# EAGLE design led_dip (EAGLE 6.5.0)
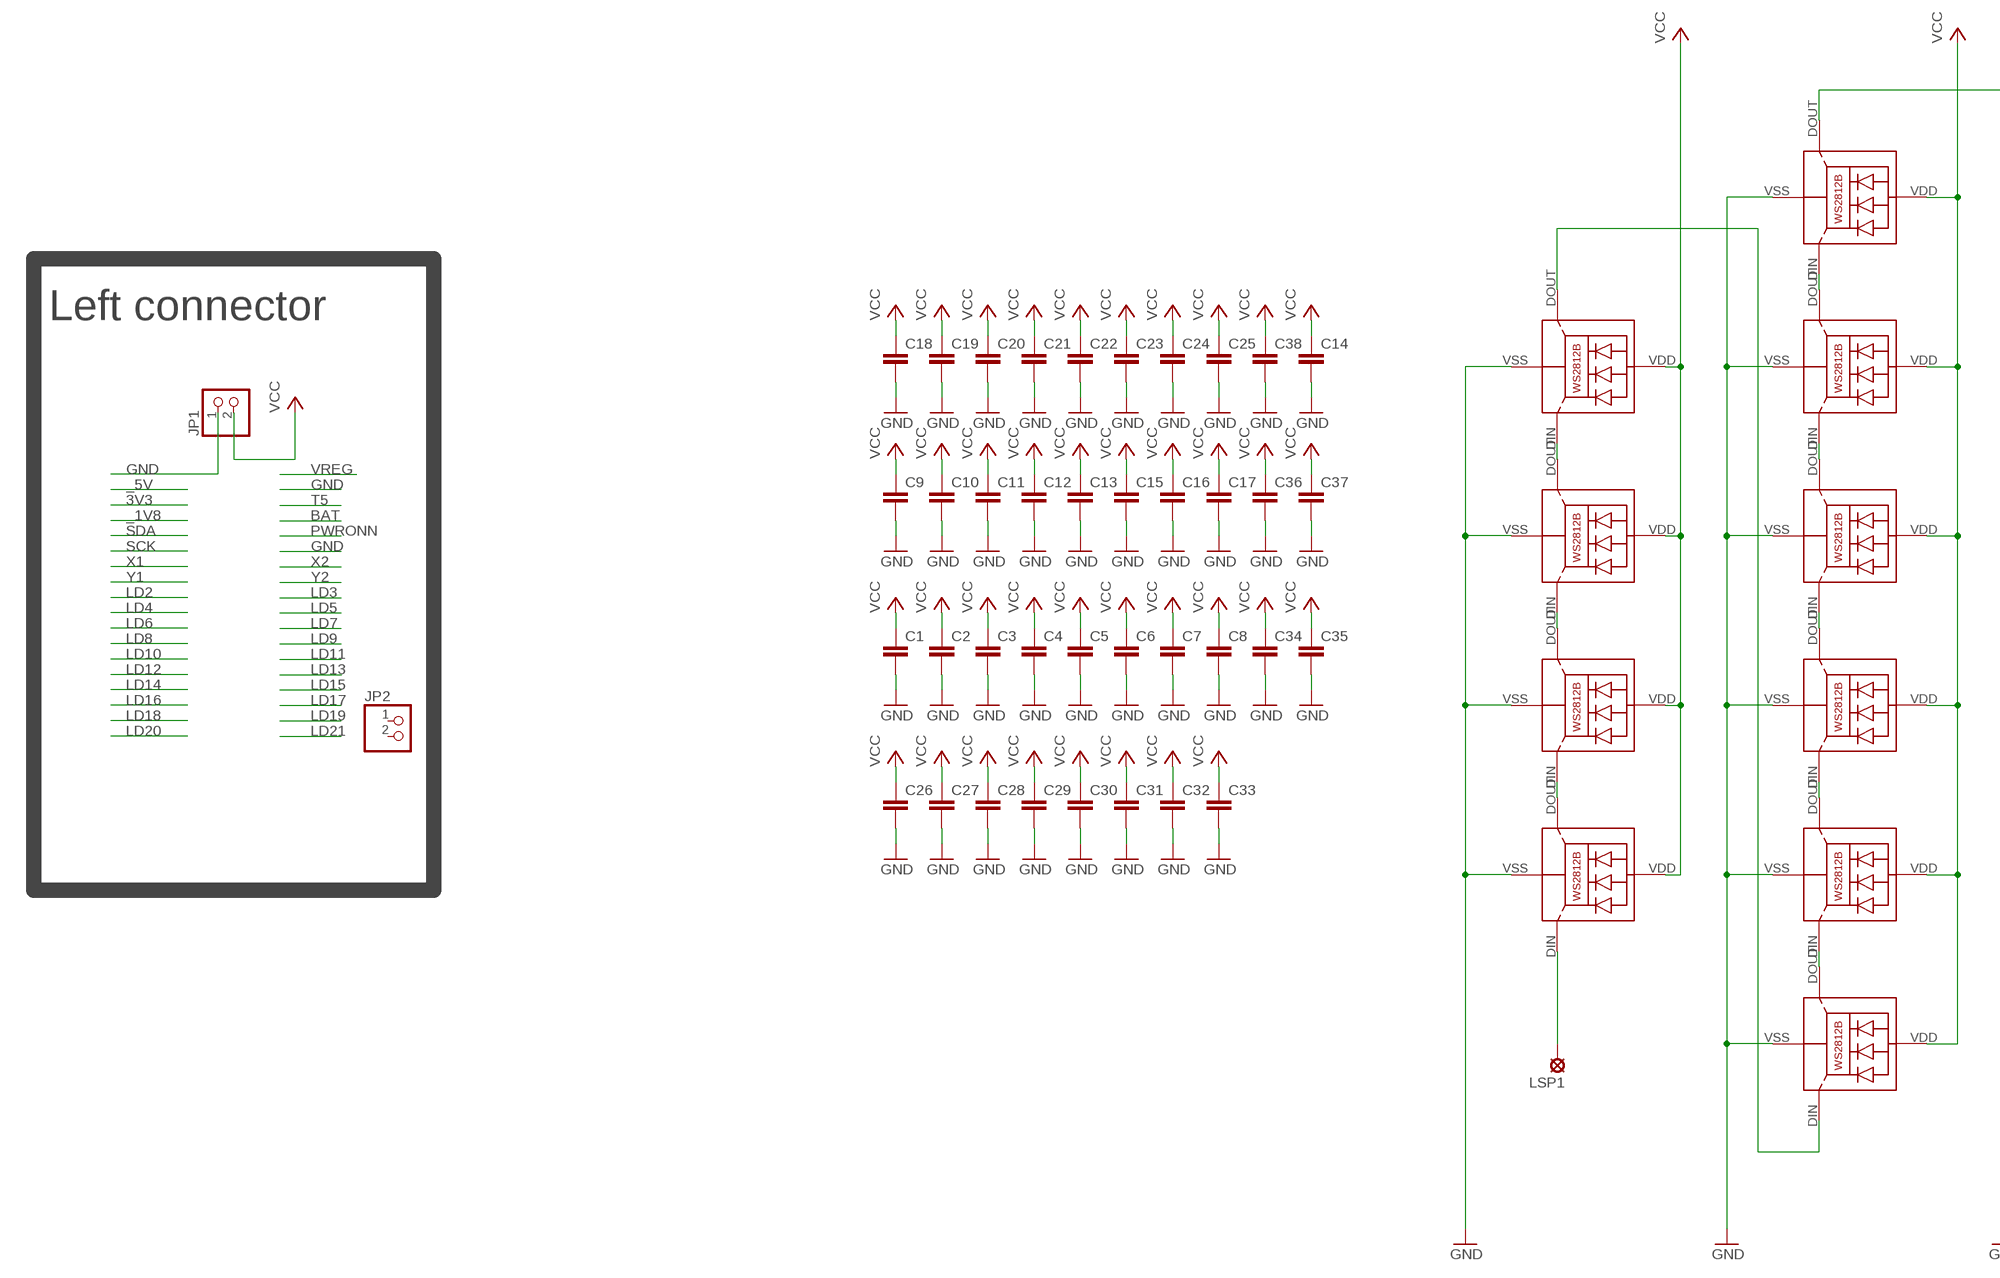
[diagram p0: schematic, sheet 1, part 1 of 2]
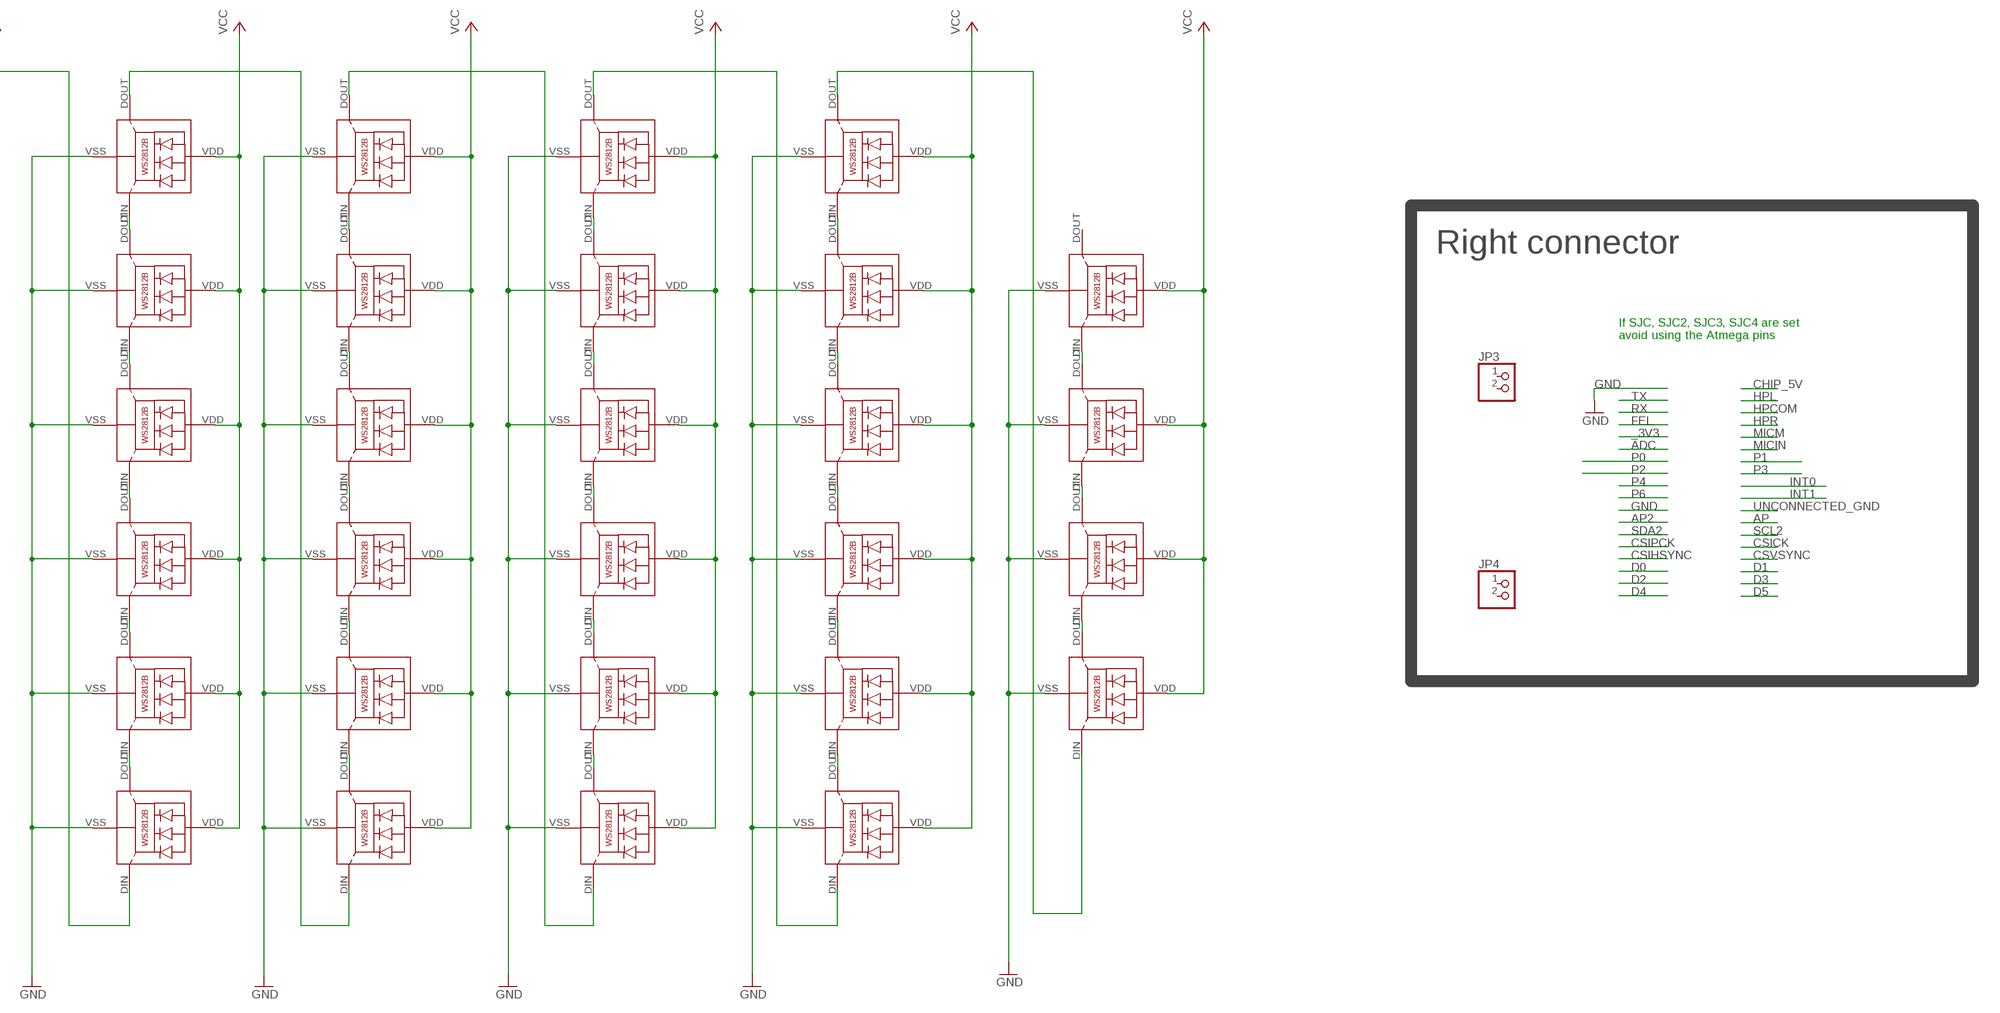
[diagram p1: schematic, sheet 1, part 2 of 2]

## Parts
C1  C-EUC0805  [C0805]
C2  C-EUC0805  [C0805]
C3  C-EUC0805  [C0805]
C4  C-EUC0805  [C0805]
C5  C-EUC0805  [C0805]
C6  C-EUC0805  [C0805]
C7  C-EUC0805  [C0805]
C8  C-EUC0805  [C0805]
C9  C-EUC0805  [C0805]
C10  C-EUC0805  [C0805]
C11  C-EUC0805  [C0805]
C12  C-EUC0805  [C0805]
C13  C-EUC0805  [C0805]
C14  C-EUC0805  [C0805]
C15  C-EUC0805  [C0805]
C16  C-EUC0805  [C0805]
C17  C-EUC0805  [C0805]
C18  C-EUC0805  [C0805]
C19  C-EUC0805  [C0805]
C20  C-EUC0805  [C0805]
C21  C-EUC0805  [C0805]
C22  C-EUC0805  [C0805]
C23  C-EUC0805  [C0805]
C24  C-EUC0805  [C0805]
C25  C-EUC0805  [C0805]
C26  C-EUC0805  [C0805]
C27  C-EUC0805  [C0805]
C28  C-EUC0805  [C0805]
C29  C-EUC0805  [C0805]
C30  C-EUC0805  [C0805]
C31  C-EUC0805  [C0805]
C32  C-EUC0805  [C0805]
C33  C-EUC0805  [C0805]
C34  C-EUC0805  [C0805]
C35  C-EUC0805  [C0805]
C36  C-EUC0805  [C0805]
C37  C-EUC0805  [C0805]
C38  C-EUC0805  [C0805]
JP1  PINHD-1X2  [1X02]
JP2  PINHD-1X2  [1X02]
JP3  PINHD-1X2  [1X02]
JP4  PINHD-1X2  [1X02]
LED1  WS2812B  [WS2812B]
LED2  WS2812B  [WS2812B]
LED3  WS2812B  [WS2812B]
LED4  WS2812B  [WS2812B]
LED5  WS2812B  [WS2812B]
LED6  WS2812B  [WS2812B]
LED7  WS2812B  [WS2812B]
LED8  WS2812B  [WS2812B]
LED9  WS2812B  [WS2812B]
LED10  WS2812B  [WS2812B]
LED11  WS2812B  [WS2812B]
LED12  WS2812B  [WS2812B]
LED13  WS2812B  [WS2812B]
LED14  WS2812B  [WS2812B]
LED15  WS2812B  [WS2812B]
LED16  WS2812B  [WS2812B]
LED17  WS2812B  [WS2812B]
LED18  WS2812B  [WS2812B]
LED19  WS2812B  [WS2812B]
LED20  WS2812B  [WS2812B]
LED21  WS2812B  [WS2812B]
LED22  WS2812B  [WS2812B]
LED23  WS2812B  [WS2812B]
LED24  WS2812B  [WS2812B]
LED25  WS2812B  [WS2812B]
LED26  WS2812B  [WS2812B]
LED27  WS2812B  [WS2812B]
LED28  WS2812B  [WS2812B]
LED30  WS2812B  [WS2812B]
LED31  WS2812B  [WS2812B]
LED32  WS2812B  [WS2812B]
LED33  WS2812B  [WS2812B]
LED34  WS2812B  [WS2812B]
LED35  WS2812B  [WS2812B]
LED36  WS2812B  [WS2812B]
LED37  WS2812B  [WS2812B]
LED38  WS2812B  [WS2812B]
LED39  WS2812B  [WS2812B]
LSP1  LSP10  [LSP10]

## Nets
GND: C1.2 C2.2 C3.2 C4.2 C5.2 C6.2 C7.2 C8.2 C9.2 C10.2 C11.2 C12.2 C13.2 C14.2 C15.2 C16.2 C17.2 C18.2 C19.2 C20.2 C21.2 C22.2 C23.2 C24.2 C25.2 C26.2 C27.2 C28.2 C29.2 C30.2 C31.2 C32.2 C33.2 C34.2 C35.2 C36.2 C37.2 C38.2 JP1.1 LED1.VSS(GND) LED2.VSS(GND) LED3.VSS(GND) LED4.VSS(GND) LED5.VSS(GND) LED6.VSS(GND) LED7.VSS(GND) LED8.VSS(GND) LED9.VSS(GND) LED10.VSS(GND) LED11.VSS(GND) LED12.VSS(GND) LED13.VSS(GND) LED14.VSS(GND) LED15.VSS(GND) LED16.VSS(GND) LED17.VSS(GND) LED18.VSS(GND) LED19.VSS(GND) LED20.VSS(GND) LED21.VSS(GND) LED22.VSS(GND) LED23.VSS(GND) LED24.VSS(GND) LED25.VSS(GND) LED26.VSS(GND) LED27.VSS(GND) LED28.VSS(GND) LED30.VSS(GND) LED31.VSS(GND) LED32.VSS(GND) LED33.VSS(GND) LED34.VSS(GND) LED35.VSS(GND) LED36.VSS(GND) LED37.VSS(GND) LED38.VSS(GND) LED39.VSS(GND)
N$1: LED14.DIN(DI) LSP1.MP
N$2: LED14.DOUT(DO) LED16.DIN(DI)
N$3: LED16.DOUT(DO) LED20.DIN(DI)
N$4: LED12.DIN(DI) LED20.DOUT(DO)
N$7: LED9.DIN(DI) LED12.DOUT(DO)
N$8: LED6.DIN(DI) LED9.DOUT(DO)
N$9: LED6.DOUT(DO) LED7.DIN(DI)
N$10: LED7.DOUT(DO) LED8.DIN(DI)
N$11: LED8.DOUT(DO) LED18.DIN(DI)
N$12: LED3.DIN(DI) LED18.DOUT(DO)
N$13: LED1.DOUT(DO) LED2.DIN(DI)
N$14: LED2.DOUT(DO) LED28.DIN(DI)
N$15: LED22.DIN(DI) LED28.DOUT(DO)
N$16: LED17.DIN(DI) LED22.DOUT(DO)
N$17: LED17.DOUT(DO) LED27.DIN(DI)
N$19: LED1.DIN(DI) LED3.DOUT(DO)
N$20: LED36.DIN(DI) LED37.DOUT(DO)
N$21: LED34.DIN(DI) LED36.DOUT(DO)
N$22: LED4.DIN(DI) LED34.DOUT(DO)
N$23: LED4.DOUT(DO) LED31.DIN(DI)
N$24: LED30.DIN(DI) LED31.DOUT(DO)
N$25: LED38.DOUT(DO) LED39.DIN(DI)
N$26: LED35.DIN(DI) LED39.DOUT(DO)
N$27: LED5.DIN(DI) LED35.DOUT(DO)
N$28: LED5.DOUT(DO) LED32.DIN(DI)
N$29: LED32.DOUT(DO) LED33.DIN(DI)
N$30: LED13.DIN(DI) LED15.DOUT(DO)
N$31: LED11.DIN(DI) LED13.DOUT(DO)
N$32: LED11.DOUT(DO) LED25.DIN(DI)
N$33: LED10.DIN(DI) LED25.DOUT(DO)
N$34: LED10.DOUT(DO) LED19.DIN(DI)
N$35: LED21.DIN(DI) LED26.DOUT(DO)
N$36: LED21.DOUT(DO) LED23.DIN(DI)
N$37: LED23.DOUT(DO) LED24.DIN(DI)
N$42: LED27.DOUT(DO) LED37.DIN(DI)
N$43: LED30.DOUT(DO) LED38.DIN(DI)
N$44: LED15.DIN(DI) LED33.DOUT(DO)
N$45: LED19.DOUT(DO) LED26.DIN(DI)
VCC: C1.1 C2.1 C3.1 C4.1 C5.1 C6.1 C7.1 C8.1 C9.1 C10.1 C11.1 C12.1 C13.1 C14.1 C15.1 C16.1 C17.1 C18.1 C19.1 C20.1 C21.1 C22.1 C23.1 C24.1 C25.1 C26.1 C27.1 C28.1 C29.1 C30.1 C31.1 C32.1 C33.1 C34.1 C35.1 C36.1 C37.1 C38.1 JP1.2 LED1.VDD LED2.VDD LED3.VDD LED4.VDD LED5.VDD LED6.VDD LED7.VDD LED8.VDD LED9.VDD LED10.VDD LED11.VDD LED12.VDD LED13.VDD LED14.VDD LED15.VDD LED16.VDD LED17.VDD LED18.VDD LED19.VDD LED20.VDD LED21.VDD LED22.VDD LED23.VDD LED24.VDD LED25.VDD LED26.VDD LED27.VDD LED28.VDD LED30.VDD LED31.VDD LED32.VDD LED33.VDD LED34.VDD LED35.VDD LED36.VDD LED37.VDD LED38.VDD LED39.VDD
Unconnected: JP2.1 JP2.2 JP3.1 JP3.2 JP4.1 JP4.2 LED24.DOUT(DO)

## Notes on the sheet
- Left connector | Right connector
- If SJC, SJC2, SJC3, SJC4 are set 
  avoid using the Atmega pins

## Library data of the parts
C1-C38 = rcl:C-EU: CAPACITOR, European symbol
JP1-JP4 = pinhead:PINHD-1X2: PIN HEADER
LED1-LED28 LED30-LED39 = WS2812B:WS2812B: Features and Benefits  * Intelligent reverse connect protection, the power supply reverse connection does not damage the IC. * The control circuit and the LED share the only power source. Control circuit and RGB chip are integrated in a package of 5050 components, form a complete control of pixel point.  * Built-in signal reshaping circuit, after wave reshaping to the next driver, ensure wave-form distortion not accumulate.  * Built-in electric reset circuit and power lost reset circuit.  * Each pixel of the three primary color can achieve 256 brightness display, completed 16777216 color full color display, and scan frequency not less than 400Hz/s.  * Cascading port transmission signal by single line.  * Any two point the distance more than 5m transmission signal without any increase circuit.  * When the refresh rate is 30fps, cascade number are not less than1024 points.  * Send data at speeds of 800Kbps.  *The color of the light were highly consistent, cost-effective. Applications  Full-color module, Full color soft lights a lamp strip. LED decorative lighting, Indoor/outdoor LED video irregular screen. General description WS2812B is a intelligent control LED light source that the control circuit and RGB chip are integrated in a package of 5050 components. It internal include intelligent digital port data latch and signal reshaping amplification drive circuit. Also include a precision internal oscillator and a 12V voltage programmable constant curre-nt control part, effectively ensuring the pixel point light color height consistent. The data transfer protocol use single NZR communication mode. After the pixel power-on reset, the DIN port receive data from controller, the first pixel collect initial 24bit data then sent to the internal data latch, the other data which reshaping by the internal signal reshaping amplification circuit sent to the next cascade pixel through the DO port. After transmission for each pixel,the signal to reduce 24bit. pixel adopt auto reshaping transmit technology, making the pixel cascade number is not limited the signal transmission, only depend on the speed of signal transmission. LED with low driving voltage, environmental protection and energy saving, high brightness, scattering angle is large, good consistency, low power, long life and other advantages. The control chip integrated in LED above becoming more simple circuit, small volume, convenient installation. Absolute Maximum Ratings Power supply voltage: VDD +3.5V..+5.3V Input voltage: VI -0.5V..VDD+0.5V based on WS2812 from https://github.com/adafruit/Adafruit-Eagle-Library
LSP1 = solpad:LSP10: SOLDER PAD drill 1.0 mm, distributor Buerklin, 12H555

## Board
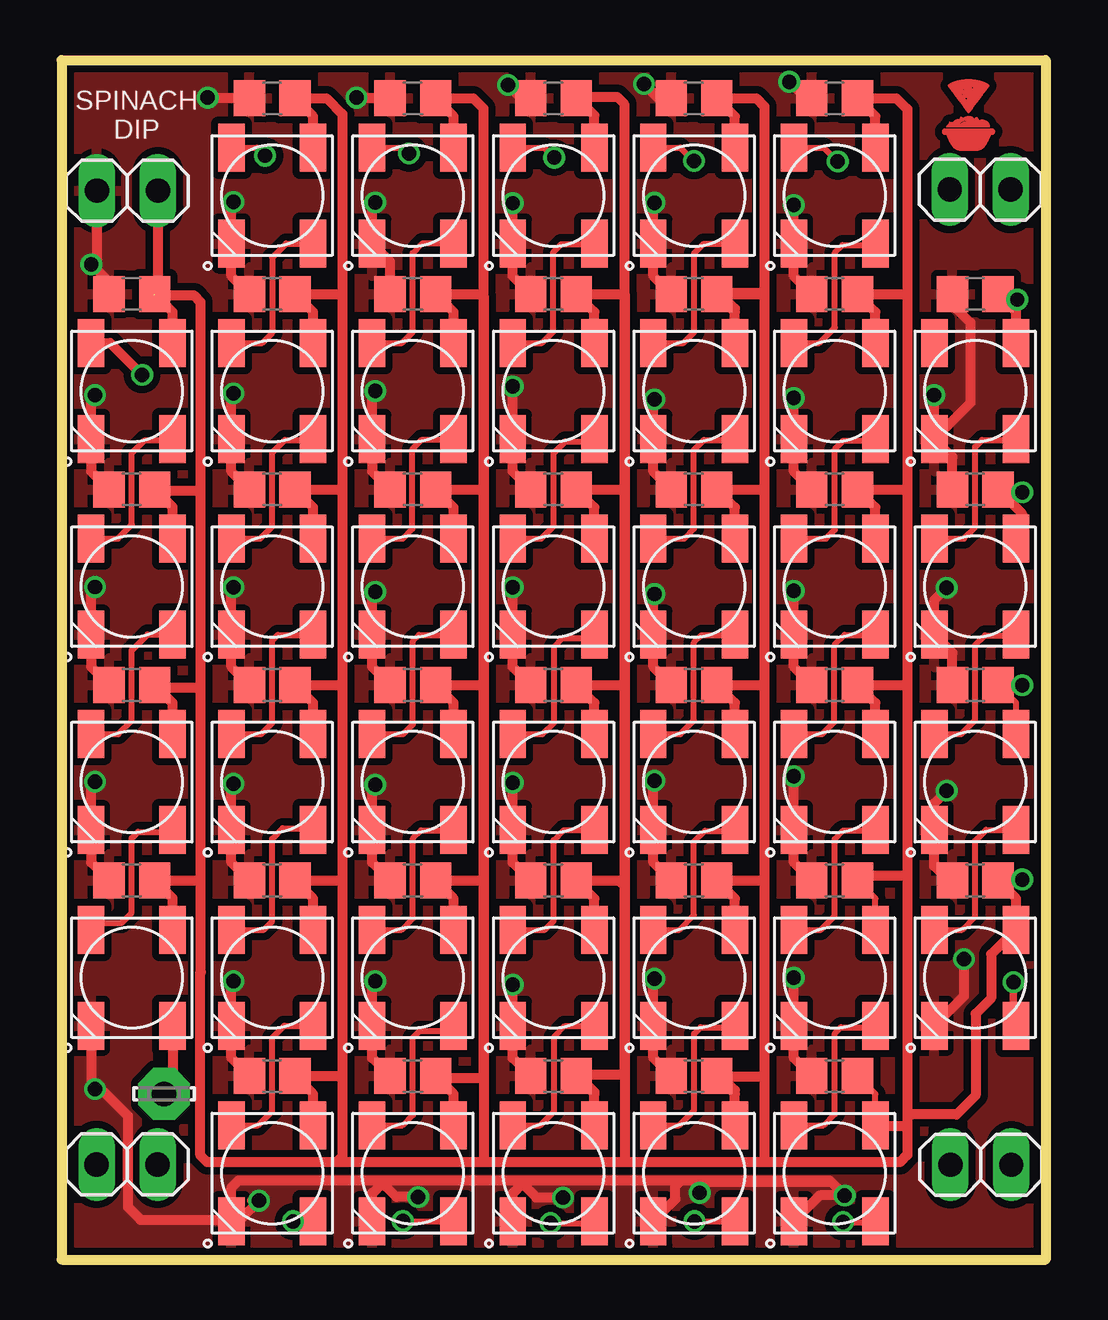
[diagram p2: board, top side]
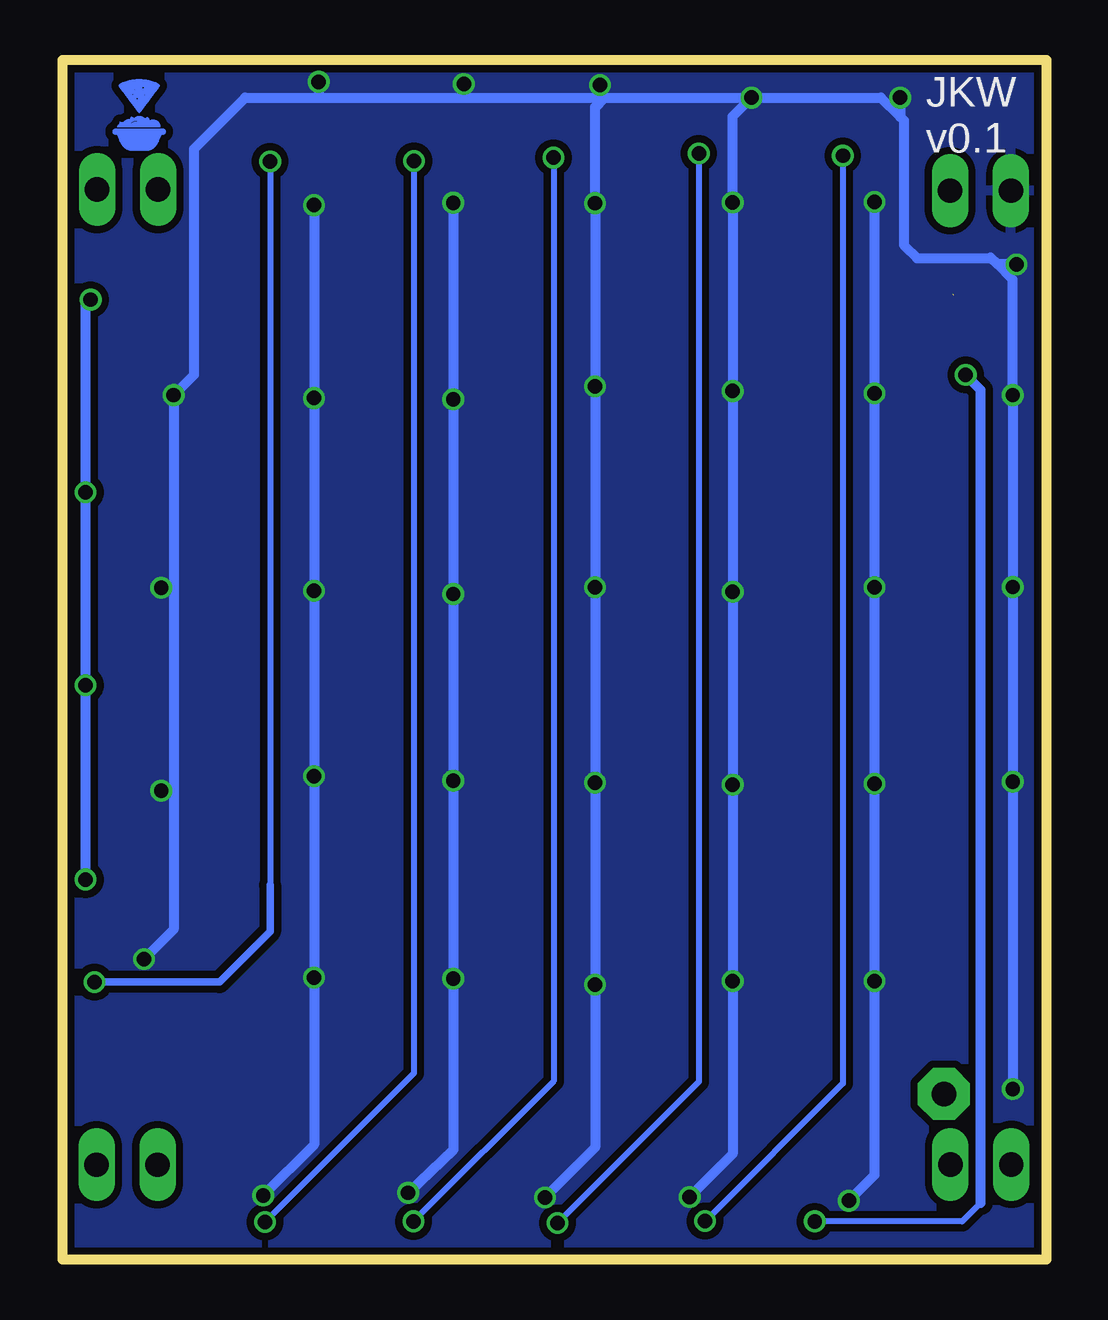
[diagram p3: board, bottom side, seen from below]

Size 41 x 50 mm. Coordinates in mm from the lower left corner, seen from the top.
Outline: 0,50 41,50 41,0 0,0 0,50
Copper layers (1*16): Top 0.035mm / dielectric 1.5mm / Bottom 0.035mm
Design rules "SeeedStudio_2layer_DRU_no_angle_20140221": minimum track width 6mil, minimum drill 12mil, track to track 6mil, track to pad 6mil, pad to pad 6mil, via to via 6mil, smd to smd 0mil, copper to edge 10mil, drill to drill 10mil, minimum pad ring 10mil, minimum via ring 6mil, stop-mask expansion 2mil, vias tented up to drill 100mil, thermal gap 10mil

### Footprints (pad centres in the part's own frame; a part is rotated, then mirrored left to right if it is on the bottom)
C0805 = smd 1.3 x 1.5: 1 -0.95,0; 2 0.95,0
1X02 = drill 1.016 long: 1 -1.27,0; 2 1.27,0
WS2812B = smd 2 x 1.1: DIN 2,1.7; DOUT -2,-1.7; VDD -2,1.7; VSS 2,-1.7
LSP10 = drill 1.016 pad 2.159 octagon: MP 0,0

### Placement (x,y rotation side)
C1  8.78,7.65 180 top
C2  8.78,15.8 180 top
C3  20.5,7.65 180 top
C4  26.36,7.65 180 top
C5  32.21,7.65 180 top
C6  14.64,48.4 180 top
C7  20.5,48.4 180 top
C8  26.36,48.4 180 top
C9  38.07,40.25 180 top
C10  32.21,48.4 180 top
C11  2.93,40.25 180 top
C12  8.78,40.25 180 top
C13  14.64,40.25 180 top
C14  8.78,48.4 180 top
C15  20.5,40.25 180 top
C16  26.36,40.25 180 top
C17  32.21,40.25 180 top
C18  2.93,32.1 180 top
C19  8.78,32.1 180 top
C20  14.64,32.1 180 top
C21  20.5,32.1 180 top
C22  26.36,32.1 180 top
C23  32.21,32.1 180 top
C24  38.07,32.1 180 top
C25  2.93,23.95 180 top
C26  8.78,23.95 180 top
C27  14.64,23.95 180 top
C28  20.5,23.95 180 top
C29  26.36,23.95 180 top
C30  32.21,23.95 180 top
C31  38.07,23.95 180 top
C32  2.93,15.8 180 top
C33  14.64,15.8 180 top
C34  20.5,15.8 180 top
C35  26.36,15.8 180 top
C36  32.21,15.8 180 top
C37  38.07,15.8 180 top
C38  14.64,7.65 180 top
JP1  2.74,44.55 0 top
JP2  2.73,3.96 180 top
JP3  38.28,44.6 0 top
JP4  38.3,3.95 0 top
LED1  14.64,3.6 270 top
LED2  14.64,11.75 270 top
LED3  8.78,44.35 270 top
LED4  20.5,28.05 270 top
LED5  26.36,28.05 270 top
LED6  8.78,11.75 270 top
LED7  8.78,19.9 270 top
LED8  8.78,28.05 270 top
LED9  8.78,3.6 270 top
LED10  32.21,36.2 270 top
LED11  32.21,19.9 270 top
LED12  2.93,36.2 270 top
LED13  32.21,11.75 270 top
LED14  2.93,11.75 270 top
LED15  32.21,3.6 270 top
LED16  2.93,19.9 270 top
LED17  14.64,36.2 270 top
LED18  8.78,36.2 270 top
LED19  32.21,44.35 270 top
LED20  2.93,28.05 270 top
LED21  38.07,19.9 270 top
LED22  14.64,28.05 270 top
LED23  38.07,28.05 270 top
LED24  38.07,36.2 270 top
LED25  32.21,28.05 270 top
LED26  38.07,11.75 270 top
LED27  14.64,44.35 270 top
LED28  14.64,19.9 270 top
LED30  20.5,44.35 270 top
LED31  20.5,36.2 270 top
LED32  26.36,36.2 270 top
LED33  26.36,44.35 270 top
LED34  20.5,19.9 270 top
LED35  26.36,19.9 270 top
LED36  20.5,11.75 270 top
LED37  20.5,3.6 270 top
LED38  26.36,3.6 270 top
LED39  26.36,11.75 270 top
LSP1  4.27,6.9 0 top
U$2  LOGO  [LOGO]  36.5,46.1 0 top
U$5  LOGO  [LOGO]  39.09,46.1 0 bottom

### Tracks (layer width: path | path; a pad name or v marks a point on that pad's centre or on a via)
GND  (via drill 0.6)
  Top 0.254: 26.94,3.23 26.94,3.13 v26.59,2.78
  Top 0.406: C13.2 13.69,41.6 LED27.VSS 12.94,43.93 v13.07,44.06 | v14.86,2.61 13.95,2.61 13.95,2.62 13.37,3.2 | v1.4,36.03 1.23,35.86 LED12.VSS 1.23,32.85 C18.2 | v7.16,44.08 7.08,44 LED3.VSS 7.08,41 C12.2 | 7.93,2.45 v8.23,2.45 7.51,1.73 7.2,1.73 7.12,1.65 3.3,1.65 2.76,2.19 2.76,6 1.66,7.1 v1.4,7.1 1.23,7.27 LED14.VSS | v18.8,44.03 LED30.VSS 18.8,41 C15.2 | v20.89,2.58 19.78,2.58 19.78,2.59 19.2,3.17 18.8,2.77 LED37.VSS | v24.71,44.05 24.66,44 LED33.VSS 24.66,41 C16.2 | LED38.VSS 25.58,2.52 25.58,3.06 25.82,3.3 | v30.51,43.95 LED19.VSS 30.51,41 C17.2 | v32.63,2.67 31.58,2.67 LED15.VSS | LED24.VSS 36.37,36.02 v36.36,36.03 | v37.6,12.52 37.6,10.98 LED26.VSS | C37.2 36.96,15.8 36.36,16.4 36.36,17.89 | 36.36,17.89 LED21.VSS | C31.2 37.12,25.3 LED23.VSS 36.37,27.49 v36.88,28 | C24.2 37.12,33.45 LED24.VSS | 36.36,17.89 36.36,19.02 v36.88,19.54 | v7.16,36.1 7.08,36.02 LED18.VSS 7.08,32.85 C19.2 | v7.16,28.02 7.08,27.94 LED8.VSS 7.08,24.7 C26.2 | v7.16,19.83 7.08,19.75 LED7.VSS 7.08,16.55 C2.2 | v7.16,11.6 7.08,11.52 LED6.VSS 7.08,8.4 C1.2 | v13.07,11.6 12.94,11.47 LED2.VSS 12.94,8.4 C38.2 | v18.8,11.46 LED36.VSS 18.8,8.4 C3.2 | v24.71,11.71 24.66,11.66 LED39.VSS 24.66,8.4 C4.2 | v24.71,19.96 24.66,19.91 LED35.VSS 24.66,16.55 C35.2 | v18.8,19.88 LED34.VSS 18.8,16.55 C34.2 | v13.07,19.79 12.94,19.66 LED28.VSS 12.94,16.55 C33.2 | v1.4,19.92 1.23,19.75 LED16.VSS 1.23,16.55 C32.2 | v1.4,28.03 1.23,27.86 LED20.VSS 1.23,24.7 C25.2 | v13.07,27.83 12.94,27.7 LED22.VSS 12.94,24.7 C27.2 | v13.07,36.2 12.94,36.07 LED17.VSS 12.94,32.85 C20.2 | v18.8,36.4 LED31.VSS 18.8,32.85 C21.2 | v18.8,28.02 LED4.VSS 18.8,24.7 C28.2
  Top 0.406: v30.51,11.75 LED13.VSS 30.51,8.4 C5.2 | v30.51,20.15 LED11.VSS 30.51,16.55 C36.2 | v24.71,27.74 24.66,27.69 LED5.VSS 24.66,24.7 C29.2 | v30.51,27.88 LED25.VSS 30.51,24.7 C30.2 | v24.71,35.85 24.66,35.8 LED32.VSS 24.66,32.85 C22.2 | v30.51,35.91 LED10.VSS 30.51,32.85 C23.2 | C11.2 1.98,40.74 v1.24,41.48 1.47,41.71 JP1.1 | C6.2 12.32,48.4 v12.29,48.43 | C10.2 31.01,48.4 v30.32,49.09 | C8.2 24.87,48.4 v24.27,49 | C7.2 19.16,48.4 v18.6,48.96 | 26.94,3.23 32.07,3.23 v32.63,2.67 | LED9.VSS 7.08,3 7.38,3.3 13.27,3.3 | 13.27,3.3 25.82,3.3 | 25.82,3.3 32,3.3 v32.63,2.67 | 13.37,3.2 13.27,3.3 | LED1.VSS 12.94,2.77 13.37,3.2 | C9.2 37.12,39.81 37.87,39.06 37.87,35.7 LED24.VSS | C14.2 6.12,48.4 v6.09,48.43
  Bottom 0.406: v14.86,2.61 13.07,4.4 v13.07,11.6 v13.07,19.79 v13.07,27.83 v13.07,36.2 v13.07,44.06 13.07,47.65 v12.29,48.43 | 1.33,7.03 v1.4,7.1 v1.4,19.92 v1.4,28.03 v1.4,36.03 1.4,40.85 2.03,41.48 | v7.16,44.08 v7.16,36.1 v7.16,28.02 v7.16,19.83 v7.16,11.6 7.16,3.52 v8.23,2.45 | v20.89,2.58 18.8,4.67 v18.8,11.46 v18.8,19.88 v18.8,28.02 v18.8,36.4 v18.8,44.03 18.8,48.04 18.41,48.43 | v24.71,44.05 v24.71,35.85 v24.71,27.74 v24.71,19.96 v24.71,11.71 24.71,4.58 v26.59,2.78 | v30.51,43.95 v30.51,35.91 v30.51,27.88 v30.51,20.15 v30.51,11.75 30.51,4.79 v32.63,2.67 | v36.36,36.03 36.36,28 | 36.36,28 36.36,19.54 | 36.36,19.54 36.36,13.76 v37.6,12.52 | v36.88,28 36.36,28 | v36.88,19.54 36.36,19.54 | 36.37,36.02 35.51,36.88 35.51,46.3 33.38,48.43 30.32,48.43 | 30.32,48.43 24.27,48.43 | 24.27,48.43 18.6,48.43 | 18.6,48.43 18.41,48.43 | 18.41,48.43 v12.29,48.43 | v12.29,48.43 6.89,48.43 6.09,47.63 | 2.03,41.48 2.32,41.77 2.36,41.73 5.38,41.73 5.94,42.29 5.94,47.48 6.09,47.63 | v1.24,41.48 2.03,41.48 | v30.32,49.09 30.32,48.43 | v24.27,49 24.27,48.43 | v18.6,48.96 18.6,48.43 | v6.09,48.43 6.09,47.63
  pour Top (isolate 0.305, rank 2): -0.07,0.25 40.88,0.25 41.01,10.57 41.01,50.01 0,50.01 0,10.47
  pour Bottom (isolate 0.305): 0,50 41.05,50 41.05,0.25 0.02,0.25 0.02,49.92
N$1
  Top 0.406: LED14.DIN 4.63,7.26 LSP1.MP
N$2
  Top 0.254: 1.12,14.04 2.51,14.04 2.92,14.45 2.92,17.56 3.19,17.83 4.56,17.83 LED16.DIN
  Top 0.305: LED14.DOUT 1.12,13.75 1.12,14.04
N$3
  Top 0.254: LED16.DOUT 2.37,21.9 2.92,22.45 2.92,25.39 3.59,26.06 4.62,26.06 LED20.DIN
N$4
  Top 0.254: LED20.DOUT 2.35,30.05 2.93,30.63 2.93,33.61 3.47,34.15 4.58,34.15 LED12.DIN
N$7  (via drill 0.6)
  Top 0.254: v9.65,1.59 LED9.DIN
  Top 0.406: LED12.DOUT 2.03,38.2 v3.36,36.87
  Bottom 0.254: 2.74,2.36 3.51,1.59 v9.65,1.59
  Bottom 0.406: 2.74,2.36 2.74,36.25 v3.36,36.87
N$8
  Top 0.254: LED9.DOUT 8.2,5.6 8.78,6.18 8.78,9.23 9.29,9.74 LED6.DIN
N$9
  Top 0.254: LED6.DOUT 8.43,13.75 8.77,14.09 8.77,17.54 9.2,17.97 10.41,17.97 LED7.DIN
N$10
  Top 0.254: LED7.DOUT 8.32,21.9 8.78,22.36 8.78,25.81 9.01,26.04 LED8.DIN
N$11
  Top 0.254: LED8.DOUT 8.28,30.05 8.78,30.55 8.78,33.63 9.31,34.16 10.44,34.16 LED18.DIN
N$12
  Top 0.254: LED18.DOUT 8.36,38.2 8.78,38.62 8.78,41.77 9.36,42.35 LED3.DIN
N$13
  Top 0.254: LED1.DOUT 14.21,5.6 14.64,6.03 14.64,9.25 14.93,9.54 16.13,9.54 LED2.DIN
N$14
  Top 0.254: LED2.DOUT 14.17,13.75 14.64,14.22 14.64,17.55 14.98,17.89 LED28.DIN
N$15
  Top 0.254: LED28.DOUT 14.23,21.9 14.64,22.31 14.64,25.78 14.9,26.04 LED22.DIN
N$16
  Top 0.254: LED22.DOUT 14.21,30.05 14.62,30.46 14.62,33.78 15.01,34.17 16.31,34.17 LED17.DIN
N$17
  Top 0.254: LED17.DOUT 14.18,38.2 14.63,38.65 14.63,41.95 15.04,42.36 LED27.DIN
N$19  (via drill 0.6)
  Top 0.254: LED3.DOUT 8.14,46.35 v8.48,46.01 | v14.22,1.6 LED1.DIN
  Bottom 0.254: v8.48,46.01 8.48,7.34 v14.22,1.6
N$20
  Top 0.254: LED37.DOUT 19.95,5.6 20.51,6.16 20.51,9.27 20.97,9.73 22.18,9.73 LED36.DIN
N$21
  Top 0.254: LED36.DOUT 20.14,13.75 20.5,14.11 20.5,17.47 20.93,17.9 LED34.DIN
N$22
  Top 0.254: LED34.DOUT 20.05,21.9 20.52,22.37 20.52,25.55 20.87,25.9 22.05,25.9 LED4.DIN
N$23
  Top 0.254: LED4.DOUT 19.98,30.05 20.5,30.57 20.5,33.62 20.98,34.1 22.1,34.1 LED31.DIN
N$24
  Top 0.254: LED31.DOUT 20.01,38.2 20.49,38.68 20.49,41.99 20.82,42.32 22.17,42.32 LED30.DIN
N$25
  Top 0.254: LED38.DOUT 25.74,5.6 26.36,6.22 26.36,9.41 26.63,9.68 27.99,9.68 LED39.DIN
N$26
  Top 0.254: LED39.DOUT 25.74,13.75 26.35,14.36 26.35,17.4 26.82,17.87 28.03,17.87 LED35.DIN 28.08,17.88
N$27
  Top 0.254: LED35.DOUT 25.79,21.9 26.35,22.46 26.35,25.71 26.67,26.03 28.04,26.03 LED5.DIN
N$28
  Top 0.254: LED5.DOUT 25.94,30.05 26.35,30.46 26.35,33.75 26.76,34.16 28.02,34.16 LED32.DIN
N$29
  Top 0.254: LED32.DOUT 25.91,38.2 26.36,38.65 26.36,41.94 26.76,42.34 28.05,42.34 LED33.DIN
N$30
  Top 0.254: LED15.DOUT 31.75,5.6 32.22,6.07 32.22,9.43 32.47,9.68 33.84,9.68 LED13.DIN 33.86,9.7
N$31
  Top 0.254: LED13.DOUT 31.64,13.75 32.21,14.32 32.21,17.53 32.56,17.88 33.89,17.88 LED11.DIN
N$32
  Top 0.254: LED11.DOUT 31.69,21.9 32.2,22.41 32.2,25.61 32.63,26.04 LED25.DIN
N$33
  Top 0.254: LED25.DOUT 31.85,30.05 32.22,30.42 32.22,33.78 32.57,34.13 33.84,34.13 LED10.DIN
N$34
  Top 0.254: LED10.DOUT 31.57,38.2 32.22,38.85 32.22,41.96 32.55,42.29 33.85,42.29 LED19.DIN
N$35
  Top 0.254: LED26.DOUT 37.52,13.75 38.07,14.3 38.07,17.45 38.53,17.91 LED21.DIN
N$36
  Top 0.254: LED21.DOUT 37.48,21.9 38.07,22.49 38.07,25.61 38.48,26.02 39.74,26.02 LED23.DIN
N$37
  Top 0.254: LED23.DOUT 37.6,30.05 38.07,30.52 38.07,33.87 38.36,34.16 39.73,34.16 LED24.DIN
N$42  (via drill 0.6)
  Top 0.254: LED27.DOUT 14.24,46.35 v14.48,46.11 | v20.37,1.52 22.12,1.52 LED37.DIN
  Bottom 0.254: v14.48,46.11 14.48,7.41 v20.37,1.52
N$43  (via drill 0.6)
  Top 0.254: LED30.DOUT 20.11,46.35 v20.53,45.93 | v26.37,1.59 28.05,1.59 LED38.DIN
  Bottom 0.254: v20.53,45.93 20.53,7.43 v26.37,1.59
N$44  (via drill 0.6)
  Top 0.254: LED33.DOUT 25.79,46.35 v26.35,45.79 | v32.56,1.56 33.87,1.56 LED15.DIN
  Bottom 0.254: v26.35,45.79 26.35,7.77 v32.56,1.56
N$45  (via drill 0.6)
  Top 0.254: LED19.DOUT 31.76,46.35 v32.34,45.77
  Top 0.305: v39.66,11.56 39.66,9.86 LED26.DIN
  Bottom 0.254: v32.34,45.77 32.34,15.61
  Bottom 0.305: 32.34,15.61 32.34,13.68 34.45,11.57 v39.65,11.57 v39.66,11.56
VCC  (via drill 0.6)  (1 unrouted)
  Top 0.254: LED15.VDD 33.91,6.9 C5.1 | LED13.VDD 33.91,15.05 C36.1 | LED21.VDD 39.77,23.2 C31.1 | LED30.VDD 22.2,47.65 C7.1
  Top 0.305: 35.43,6.04 35.24,5.85
  Top 0.406: LED30.VDD 22.2,47.69 21.43,48.46 23.15,48.46 23.44,48.17 23.44,40.27 | 23.44,40.27 23.44,32.02 | 23.44,32.02 23.44,24.07 | 23.44,24.07 23.44,15.57 | 23.44,15.57 23.44,7.71 21.47,7.71 22.2,6.98 LED37.VDD 22.2,6.9 C3.1 | 35.24,40.25 35.24,47.95 34.79,48.4 C10.1 33.91,47.65 LED19.VDD | 35.24,40.25 35.24,32.04 | 35.24,32.04 35.24,24.05 | 35.24,24.05 35.24,16.02 | 35.24,16.02 35.24,5.85 35.24,5.57 | 35.24,5.57 35.24,5.47 | 35.24,5.47 35.25,5.46 | 29.29,40.3 29.29,48.07 28.96,48.4 C8.1 28.06,47.65 LED33.VDD | 29.29,40.3 29.29,32.11 | 29.29,32.11 29.29,23.87 | 29.29,23.87 29.29,15.84 | 29.29,15.84 29.29,7.62 29.28,7.63 27.48,7.63 28.06,7.05 LED38.VDD 28.06,6.9 C4.1 | 17.58,40.27 17.58,47.98 17.16,48.4 C6.1 16.34,47.65 LED27.VDD | 17.58,40.27 17.58,32.13 | 17.58,32.13 17.58,24.08 | 17.58,24.08 17.58,15.89 | 17.58,15.89 17.58,7.6 17.55,7.57 15.66,7.57 16.34,6.89 LED1.VDD 16.34,6.9 C38.1 | 11.7,40.22 11.7,47.75 11.05,48.4 C14.1 10.48,47.65 LED3.VDD | 11.7,40.22 11.7,32.11 | 11.7,32.11 11.7,24.02 | 11.7,24.02 11.7,15.67 | 11.7,15.67 11.7,7.49 | 3.85,40.19 5.52,40.19 5.79,39.92 5.79,32.02 | 5.79,32.02 5.79,23.8 | 5.79,23.8 5.79,15.72 | 5.79,15.72 5.79,12 | 5.79,12 5.81,11.98 | C32.1 4.63,15.05 LED14.VDD 4.63,15.06 C32.1 5.71,15.8 5.79,15.72 | C25.1 4.63,23.2 LED16.VDD 4.63,23.17 3.96,23.84 5.75,23.84 5.79,23.8 | C18.1 4.63,31.35 LED20.VDD 4.63,31.37 3.94,32.06 5.75,32.06 5.79,32.02 | LED12.VDD 4.63,39.5 C11.1 4.01,40.38 JP1.2 | LED9.VDD 10.48,6.9 C1.1 11.54,7.65 11.7,7.49 | LED6.VDD 10.48,15.05 C2.1 11.57,15.8 11.7,15.67 | LED7.VDD 10.48,23.2 C26.1 11.63,23.95 11.7,24.02 | LED8.VDD 10.48,31.35 C19.1 11.69,32.1 11.7,32.11
  Top 0.406: LED18.VDD 10.48,39.5 C12.1 11.67,40.25 11.7,40.22 | LED17.VDD 16.34,39.5 C13.1 | C13.1 17.56,40.25 17.58,40.27 | LED22.VDD 16.34,31.35 C20.1 17.55,32.1 17.58,32.13 | LED28.VDD 16.34,23.2 C27.1 17.45,23.95 17.58,24.08 | LED2.VDD 16.34,15.05 C33.1 17.49,15.8 17.58,15.89 | LED36.VDD 22.2,15.05 C34.1 23.21,15.8 23.44,15.57 | LED39.VDD 28.06,15.05 C35.1 29.25,15.8 29.29,15.84 | LED34.VDD 22.2,23.2 C28.1 23.32,23.95 23.44,24.07 | LED35.VDD 28.06,23.2 C29.1 29.21,23.95 29.29,23.87 | LED4.VDD 22.2,31.35 C21.1 23.36,32.1 23.44,32.02 | LED5.VDD 28.06,31.35 C22.1 29.28,32.1 29.29,32.11 | LED25.VDD 33.91,31.35 C23.1 35.18,32.1 35.24,32.04 | LED11.VDD 33.91,23.2 C30.1 35.14,23.95 35.24,24.05 | LED10.VDD 33.91,39.5 C17.1 35.24,40.25 | LED32.VDD 28.06,39.5 | 28.06,39.5 C16.1 29.19,40.25 29.27,40.33 29.27,4.1 29.23,4.06 | 28.06,39.5 28.06,39.64 27.4,40.3 29.29,40.3 | LED31.VDD 22.2,39.5 C15.1 | C15.1 23.42,40.25 23.44,40.27 | v40.03,15.84 39.99,15.8 C37.1 39.77,15.05 LED26.VDD 38.73,12.72 38.73,10.89 38.09,10.25 38.09,6.84 37.3,6.05 35.44,6.05 35.43,6.04 | v40.03,31.98 39.14,31.98 C24.1 40.03,31.09 40.03,30.48 39.77,30.22 LED23.VDD | C31.1 v40.02,23.95 v40.03,23.94 | 5.79,12 5.79,4.34 6.07,4.06 11.45,4.06 | LED15.VDD 33.94,5.57 35.24,5.57 | v39.82,40.01 39.62,40.21 39,40.21 39.02,40.23 C9.1 39.77,39.5 LED24.VDD | C36.1 33.38,16.02 35.24,16.02 | 35.24,5.47 35.24,4.36 34.94,4.06 29.23,4.06 | 29.23,4.06 23.55,4.06 | 23.55,4.06 17.55,4.06 | 17.55,4.06 11.45,4.06 | 11.7,7.49 11.7,4.31 11.45,4.06 | C13.1 17.52,40.25 17.59,40.18 17.59,4.1 17.55,4.06 | C15.1 23.44,40.25 23.46,40.23 23.46,4.15 23.55,4.06
  Bottom 0.406: v40.03,15.84 v40.03,23.94 v40.03,31.98 40.03,39.8 v39.82,40.01

### Text on the board
tNames: SPINACH / DIP
bNames: JKW / v0.1